# EAGLE schematic Auto_Final_v2.0 (EAGLE 8.0.1)
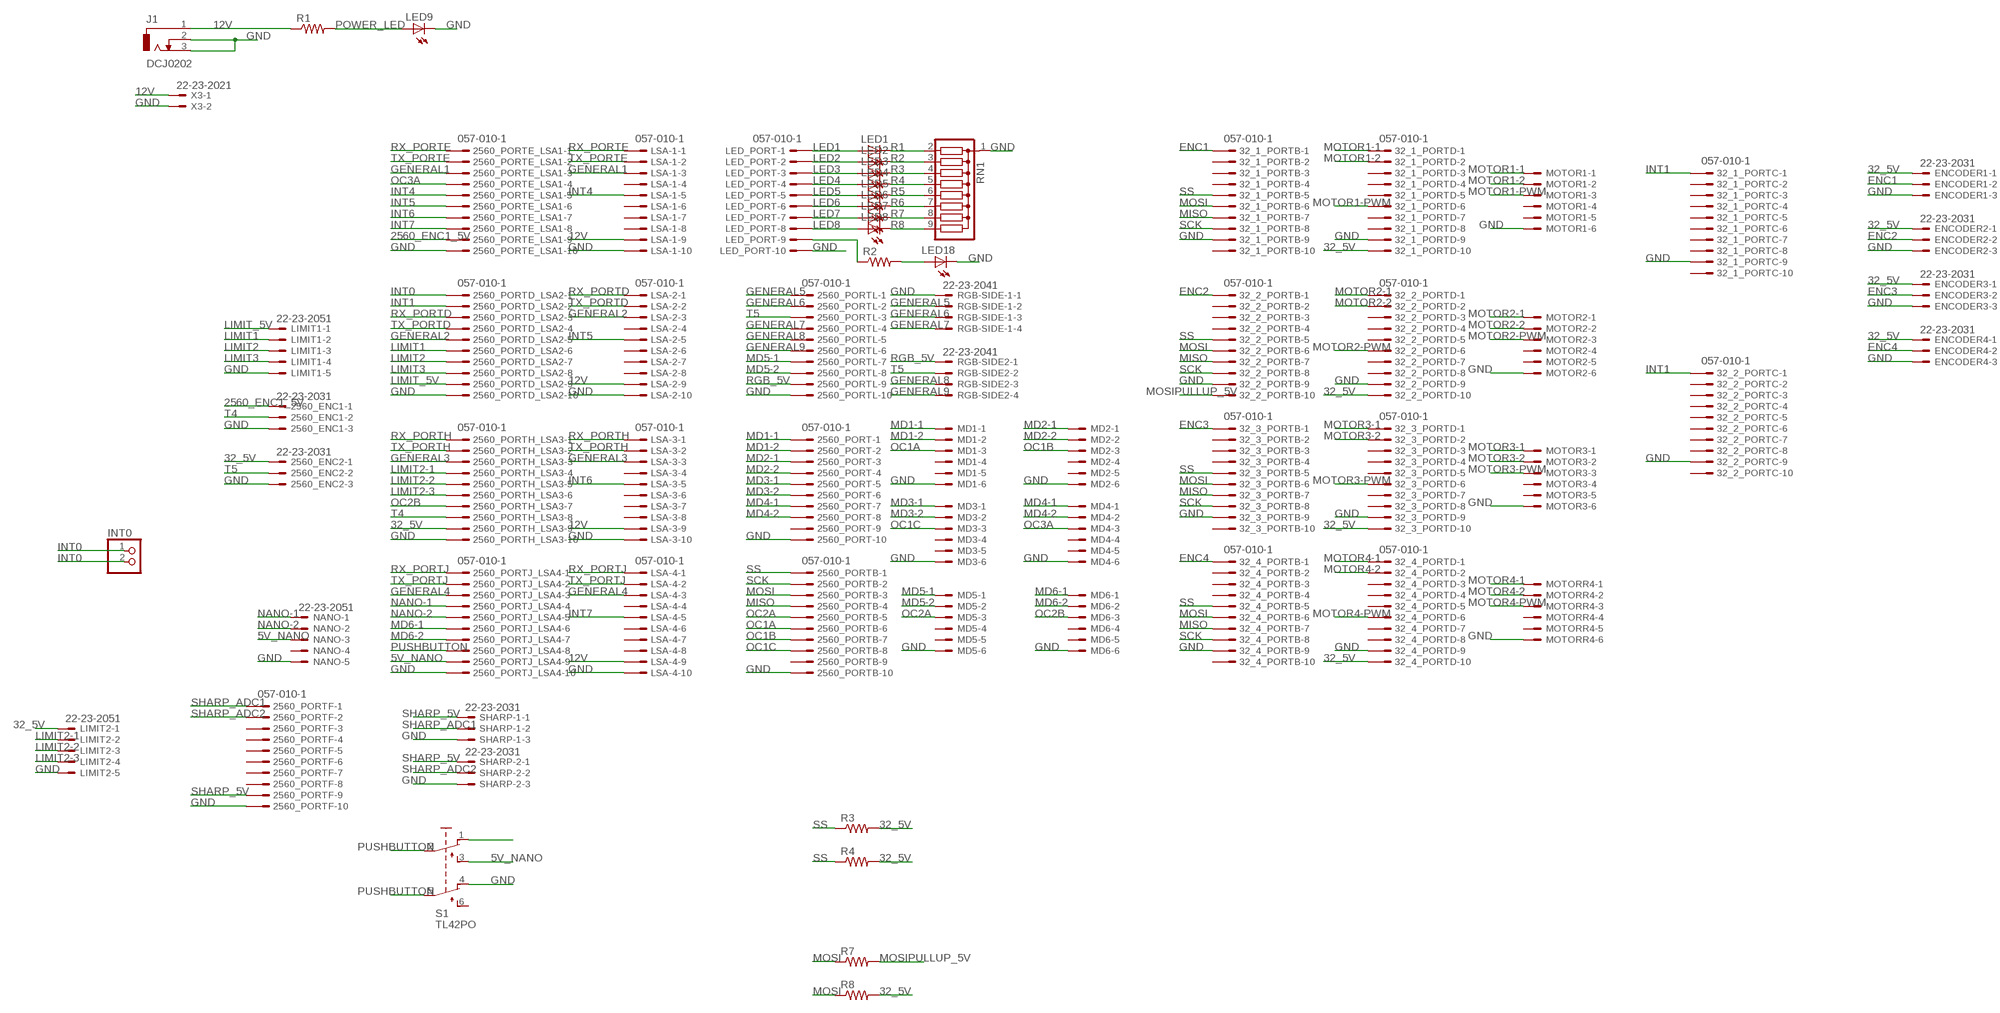
[diagram p0: schematic, sheet 1]

## Parts
32_1_PORTB  057-010-1  [057-010-1]
32_1_PORTC  057-010-1  [057-010-1]
32_1_PORTD  057-010-1  [057-010-1]
32_2_PORTB  057-010-1  [057-010-1]
32_2_PORTC  057-010-1  [057-010-1]
32_2_PORTD  057-010-1  [057-010-1]
32_3_PORTB  057-010-1  [057-010-1]
32_3_PORTD  057-010-1  [057-010-1]
32_4_PORTB  057-010-1  [057-010-1]
32_4_PORTD  057-010-1  [057-010-1]
2560_ENC1  22-23-2031  [22-23-2031]
2560_ENC2  22-23-2031  [22-23-2031]
2560_PORT  057-010-1  [057-010-1]
2560_PORTB  057-010-1  [057-010-1]
2560_PORTD_LSA2  057-010-1  [057-010-1]
2560_PORTE_LSA1  057-010-1  [057-010-1]
2560_PORTF  057-010-1  [057-010-1]
2560_PORTH_LSA3  057-010-1  [057-010-1]
2560_PORTJ_LSA4  057-010-1  [057-010-1]
2560_PORTL  057-010-1  [057-010-1]
ENCODER1  22-23-2031  [22-23-2031]
ENCODER2  22-23-2031  [22-23-2031]
ENCODER3  22-23-2031  [22-23-2031]
ENCODER4  22-23-2031  [22-23-2031]
INT0  PINHD-1X2  [1X02]
J1  DCJ0202  [DCJ0202]
LED1  LED3MM  [LED3MM]
LED2  LED3MM  [LED3MM]
LED3  LED3MM  [LED3MM]
LED4  LED3MM  [LED3MM]
LED5  LED3MM  [LED3MM]
LED6  LED3MM  [LED3MM]
LED7  LED3MM  [LED3MM]
LED8  LED3MM  [LED3MM]
LED9  LED5MM  [LED5MM]
LED18  LED3MM  [LED3MM]
LED_PORT  057-010-1  [057-010-1]
LIMIT1  22-23-2051  [22-23-2051]
LIMIT2  22-23-2051  [22-23-2051]
LSA-1  057-010-1  [057-010-1]
LSA-2  057-010-1  [057-010-1]
LSA-3  057-010-1  [057-010-1]
LSA-4  057-010-1  [057-010-1]
MD1  22-23-2061  [22-23-2061]
MD2  22-23-2061  [22-23-2061]
MD3  22-23-2061  [22-23-2061]
MD4  22-23-2061  [22-23-2061]
MD5  22-23-2061  [22-23-2061]
MD6  22-23-2061  [22-23-2061]
MOTOR1  22-23-2061  [22-23-2061]
MOTOR2  22-23-2061  [22-23-2061]
MOTOR3  22-23-2061  [22-23-2061]
MOTORR4  22-23-2061  [22-23-2061]
NANO  22-23-2051  [22-23-2051]
R1  R-US_0204/7  [0204/7]
R2  R-US_0204/7  [0204/7]
R3  R-US_0204/7  [0204/7]
R4  R-US_0204/7  [0204/7]
R7  R-US_0204/7  [0204/7]
R8  R-US_0204/7  [0204/7]
RGB-SIDE2  22-23-2041  [22-23-2041]
RGB-SIDE-1  22-23-2041  [22-23-2041]
RN1  G08R  [SIL9]
S1  TL42PO  [TL4XPO]
SHARP-1  22-23-2031  [22-23-2031]
SHARP-2  22-23-2031  [22-23-2031]
X3  22-23-2021  [22-23-2021]

## Nets
5V_NANO: 2560_PORTJ_LSA4.9 NANO.3 S1.3(S)
12V: J1.1 LSA-1.9 LSA-2.9 LSA-3.9 LSA-4.9 R1.1 X3.1
32_5V: 32_1_PORTD.10 32_2_PORTD.10 32_3_PORTD.10 32_4_PORTD.10 2560_ENC2.1 2560_PORTH_LSA3.9 ENCODER1.1 ENCODER2.1 ENCODER3.1 ENCODER4.1 LIMIT2.1 R3.2 R4.2 R8.2
2560_ENC1_5V: 2560_ENC1.1 2560_PORTE_LSA1.9
2560_PLED: LED_PORT.9 R2.1
ENC1: 32_1_PORTB.1 ENCODER1.2
ENC2: 32_2_PORTB.1 ENCODER2.2
ENC3: 32_3_PORTB.1 ENCODER3.2
ENC4: 32_4_PORTB.1 ENCODER4.2
GENERAL1: 2560_PORTE_LSA1.3 LSA-1.3
GENERAL2: 2560_PORTD_LSA2.5 LSA-2.3
GENERAL3: 2560_PORTH_LSA3.3 LSA-3.3
GENERAL4: 2560_PORTJ_LSA4.3 LSA-4.3
GENERAL5: 2560_PORTL.1 RGB-SIDE-1.2
GENERAL6: 2560_PORTL.2 RGB-SIDE-1.3
GENERAL7: 2560_PORTL.4 RGB-SIDE-1.4
GENERAL8: 2560_PORTL.5 RGB-SIDE2.3
GENERAL9: 2560_PORTL.6 RGB-SIDE2.4
GND: 32_1_PORTB.9 32_1_PORTC.9 32_1_PORTD.9 32_2_PORTB.9 32_2_PORTC.9 32_2_PORTD.9 32_3_PORTB.9 32_3_PORTD.9 32_4_PORTB.9 32_4_PORTD.9 2560_ENC1.3 2560_ENC2.3 2560_PORT.10 2560_PORTB.10 2560_PORTD_LSA2.10 2560_PORTE_LSA1.10 2560_PORTF.10 2560_PORTH_LSA3.10 2560_PORTJ_LSA4.10 2560_PORTL.10 ENCODER1.3 ENCODER2.3 ENCODER3.3 ENCODER4.3 J1.2 J1.3 LED9.K(C) LED18.K(C) LED_PORT.10 LIMIT1.5 LIMIT2.5 LSA-1.10 LSA-2.10 LSA-3.10 LSA-4.10 MD1.6 MD2.6 MD3.6 MD4.6 MD5.6 MD6.6 MOTOR1.6 MOTOR2.6 MOTOR3.6 MOTORR4.6 NANO.5 RGB-SIDE-1.1 RN1.1 S1.4(O1) SHARP-1.3 SHARP-2.3 X3.2
INT0: 2560_PORTD_LSA2.1 INT0.1 INT0.2
INT1: 32_1_PORTC.1 32_2_PORTC.1 2560_PORTD_LSA2.2
INT4: 2560_PORTE_LSA1.5 LSA-1.5
INT5: 2560_PORTE_LSA1.6 LSA-2.5
INT6: 2560_PORTE_LSA1.7 LSA-3.5
INT7: 2560_PORTE_LSA1.8 LSA-4.5
LED1: LED1.A LED_PORT.1
LED2: LED2.A LED_PORT.2
LED3: LED3.A LED_PORT.3
LED4: LED4.A LED_PORT.4
LED5: LED5.A LED_PORT.5
LED6: LED6.A LED_PORT.6
LED7: LED7.A LED_PORT.7
LED8: LED8.A LED_PORT.8
LIMIT1: 2560_PORTD_LSA2.6 LIMIT1.2
LIMIT2: 2560_PORTD_LSA2.7 LIMIT1.3
LIMIT2-1: 2560_PORTH_LSA3.4 LIMIT2.2
LIMIT2-2: 2560_PORTH_LSA3.5 LIMIT2.3
LIMIT2-3: 2560_PORTH_LSA3.6 LIMIT2.4
LIMIT3: 2560_PORTD_LSA2.8 LIMIT1.4
LIMIT_5V: 2560_PORTD_LSA2.9 LIMIT1.1
MD1-1: 2560_PORT.1 MD1.1
MD1-2: 2560_PORT.2 MD1.2
MD2-1: 2560_PORT.3 MD2.1
MD2-2: 2560_PORT.4 MD2.2
MD3-1: 2560_PORT.5 MD3.1
MD3-2: 2560_PORT.6 MD3.2
MD4-1: 2560_PORT.7 MD4.1
MD4-2: 2560_PORT.8 MD4.2
MD5-1: 2560_PORTL.7 MD5.1
MD5-2: 2560_PORTL.8 MD5.2
MD6-1: 2560_PORTJ_LSA4.6 MD6.1
MD6-2: 2560_PORTJ_LSA4.7 MD6.2
MISO: 32_1_PORTB.7 32_2_PORTB.7 32_3_PORTB.7 32_4_PORTB.7 2560_PORTB.4
MOSI: 32_1_PORTB.6 32_2_PORTB.6 32_3_PORTB.6 32_4_PORTB.6 2560_PORTB.3 R7.1 R8.1
MOSIPULLUP_5V: 32_2_PORTB.10 R7.2
MOTOR1-1: 32_1_PORTD.1 MOTOR1.1
MOTOR1-2: 32_1_PORTD.2 MOTOR1.2
MOTOR1-PWM: 32_1_PORTD.6 MOTOR1.3
MOTOR2-1: 32_2_PORTD.1 MOTOR2.1
MOTOR2-2: 32_2_PORTD.2 MOTOR2.2
MOTOR2-PWM: 32_2_PORTD.6 MOTOR2.3
MOTOR3-1: 32_3_PORTD.1 MOTOR3.1
MOTOR3-2: 32_3_PORTD.2 MOTOR3.2
MOTOR3-PWM: 32_3_PORTD.6 MOTOR3.3
MOTOR4-1: 32_4_PORTD.1 MOTORR4.1
MOTOR4-2: 32_4_PORTD.2 MOTORR4.2
MOTOR4-PWM: 32_4_PORTD.6 MOTORR4.3
N$3: S1.1(O)
NANO-1: 2560_PORTJ_LSA4.4 NANO.1
NANO-2: 2560_PORTJ_LSA4.5 NANO.2
OC1A: 2560_PORTB.6 MD1.3
OC1B: 2560_PORTB.7 MD2.3
OC1C: 2560_PORTB.8 MD3.3
OC2A: 2560_PORTB.5 MD5.3
OC2B: 2560_PORTH_LSA3.7 MD6.3
OC3A: 2560_PORTE_LSA1.4 MD4.3
POWER_LED: LED9.A R1.2
POWERLED2560: LED18.A R2.2
PUSHBUTTON: 2560_PORTJ_LSA4.8 S1.2(P) S1.5(P1)
R1: LED1.K(C) RN1.2
R2: LED2.K(C) RN1.3
R3: LED3.K(C) RN1.4
R4: LED4.K(C) RN1.5
R5: LED5.K(C) RN1.6
R6: LED6.K(C) RN1.7
R7: LED7.K(C) RN1.8
R8: LED8.K(C) RN1.9
RGB_5V: 2560_PORTL.9 RGB-SIDE2.1
RX_PORTD: 2560_PORTD_LSA2.3 LSA-2.1
RX_PORTE: 2560_PORTE_LSA1.1 LSA-1.1
RX_PORTH: 2560_PORTH_LSA3.1 LSA-3.1
RX_PORTJ: 2560_PORTJ_LSA4.1 LSA-4.1
SCK: 32_1_PORTB.8 32_2_PORTB.8 32_3_PORTB.8 32_4_PORTB.8 2560_PORTB.2
SHARP_5V: 2560_PORTF.9 SHARP-1.1 SHARP-2.1
SHARP_ADC1: 2560_PORTF.1 SHARP-1.2
SHARP_ADC2: 2560_PORTF.2 SHARP-2.2
SS: 32_1_PORTB.5 32_2_PORTB.5 32_3_PORTB.5 32_4_PORTB.5 2560_PORTB.1 R3.1 R4.1
T4: 2560_ENC1.2 2560_PORTH_LSA3.8
T5: 2560_ENC2.2 2560_PORTL.3 RGB-SIDE2.2
TX_PORTD: 2560_PORTD_LSA2.4 LSA-2.2
TX_PORTE: 2560_PORTE_LSA1.2 LSA-1.2
TX_PORTH: 2560_PORTH_LSA3.2 LSA-3.2
TX_PORTJ: 2560_PORTJ_LSA4.2 LSA-4.2
Unconnected: 32_1_PORTB.2 32_1_PORTB.3 32_1_PORTB.4 32_1_PORTB.10 32_1_PORTC.2 32_1_PORTC.3 32_1_PORTC.4 32_1_PORTC.5 32_1_PORTC.6 32_1_PORTC.7 32_1_PORTC.8 32_1_PORTC.10 32_1_PORTD.3 32_1_PORTD.4 32_1_PORTD.5 32_1_PORTD.7 32_1_PORTD.8 32_2_PORTB.2 32_2_PORTB.3 32_2_PORTB.4 32_2_PORTC.2 32_2_PORTC.3 32_2_PORTC.4 32_2_PORTC.5 32_2_PORTC.6 32_2_PORTC.7 32_2_PORTC.8 32_2_PORTC.10 32_2_PORTD.3 32_2_PORTD.4 32_2_PORTD.5 32_2_PORTD.7 32_2_PORTD.8 32_3_PORTB.2 32_3_PORTB.3 32_3_PORTB.4 32_3_PORTB.10 32_3_PORTD.3 32_3_PORTD.4 32_3_PORTD.5 32_3_PORTD.7 32_3_PORTD.8 32_4_PORTB.2 32_4_PORTB.3 32_4_PORTB.4 32_4_PORTB.10 32_4_PORTD.3 32_4_PORTD.4 32_4_PORTD.5 32_4_PORTD.7 32_4_PORTD.8 2560_PORT.9 2560_PORTB.9 2560_PORTF.3 2560_PORTF.4 2560_PORTF.5 2560_PORTF.6 2560_PORTF.7 2560_PORTF.8 LSA-1.4 LSA-1.6 LSA-1.7 LSA-1.8 LSA-2.4 LSA-2.6 LSA-2.7 LSA-2.8 LSA-3.4 LSA-3.6 LSA-3.7 LSA-3.8 LSA-4.4 LSA-4.6 LSA-4.7 LSA-4.8 MD1.4 MD1.5 MD2.4 MD2.5 MD3.4 MD3.5 MD4.4 MD4.5 MD5.4 MD5.5 MD6.4 MD6.5 MOTOR1.4 MOTOR1.5 MOTOR2.4 MOTOR2.5 MOTOR3.4 MOTOR3.5 MOTORR4.4 MOTORR4.5 NANO.4 S1.6(S1)

## Library data of the parts
32_1_PORTB 32_1_PORTC 32_1_PORTD 32_2_PORTB 32_2_PORTC 32_2_PORTD 32_3_PORTB 32_3_PORTD 32_4_PORTB 32_4_PORTD 2560_PORT 2560_PORTB 2560_PORTD_LSA2 2560_PORTE_LSA1 2560_PORTF 2560_PORTH_LSA3 2560_PORTJ_LSA4 2560_PORTL LED_PORT LSA-1-LSA-4 = con-panduit:057-010-: CONNECTOR 10-pin series 057 contact pc board low profile headers; OC_FARNELL: unknown; OC_NEWARK: unknown
2560_ENC1 2560_ENC2 ENCODER1-ENCODER4 SHARP-1 SHARP-2 = con-molex:22-23-2031: .100" (2.54mm) Center Header - 3 Pin; MF: MOLEX; MPN: 22-23-2031; OC_FARNELL: 1462950; OC_NEWARK: 30C0862
INT0 = pinhead:PINHD-1X2: PIN HEADER
J1 = con-jack:DCJ0202: DC POWER JACK Source: DCJ0202.pdf; OC_FARNELL: unknown; OC_NEWARK: unknown
LED1-LED9 LED18 = led:LED: LED OSRAM: - CHIPLED LG R971, LG N971, LY N971, LG Q971, LY Q971, LO R971, LY R971 LH N974, LH R974 LS Q976, LO Q976, LY Q976 LO Q996 - Hyper CHIPLED LW Q18S LB Q993, LB Q99A, LB R99A - SideLED LS A670, LO A670, LY A670, LG A670, LP A670 LB A673, LV A673, LT A673, LW A673 LH A674 LY A675 LS A676, LA A676, LO A676, LY A676, LW A676 LS A679, LY A679, LG A679 - Hyper Micro SIDELED® LS Y876, LA Y876, LO Y876, LY Y876 LT Y87S - SmartLED LW L88C, LW L88S LB L89C, LB L89S, LG L890 LS L89K, LO L89K, LY L89K LS L896, LA L896, LO L896, LY L896 - TOPLED LS T670, LO T670, LY T670, LG T670, LP T670 LSG T670, LSP T670, LSY T670, LOP T670, LYG T670 LG T671, LOG T671, LSG T671 LB T673, LV T673, LT T673, LW T673 LH T674 LS T676, LA T676, LO T676, LY T676, LB T676, LH T676, LSB T676, LW T676 LB T67C, LV T67C, LT T67C, LS T67K, LO T67K, LY T67K, LW E67C LS E67B, LA E67B, LO E67B, LY E67B, LB E67C, LV E67C, LT E67C LW T67C LS T679, LY T679, LG T679 LS T770, LO T770, LY T770, LG T770, LP T770 LB T773, LV T773, LT T773, LW T773 LH T774 LS E675, LA E675, LY E675, LS T675 LS T776, LA T776, LO T776, LY T776, LB T776 LHGB T686 LT T68C, LB T68C - Hyper Mini TOPLED® LB M676 - Mini TOPLED Santana® LG M470 LS M47K, LO M47K, LY M47K Source: http://www.osram.convergy.de LUXEON: - LUMILED® LXK2-PW12-R00, LXK2-PW12-S00, LXK2-PW14-U00, LXK2-PW14-V00 LXK2-PM12-R00, LXK2-PM12-S00, LXK2-PM14-U00 LXK2-PE12-Q00, LXK2-PE12-R00, LXK2-PE12-S00, LXK2-PE14-T00, LXK2-PE14-U00 LXK2-PB12-K00, LXK2-PB12-L00, LXK2-PB12-M00, LXK2-PB14-N00, LXK2-PB14-P00, LXK2-PB14-Q00 LXK2-PR12-L00, LXK2-PR12-M00, LXK2-PR14-Q00, LXK2-PR14-R00 LXK2-PD12-Q00, LXK2-PD12-R00, LXK2-PD12-S00 LXK2-PH12-R00, LXK2-PH12-S00 LXK2-PL12-P00, LXK2-PL12-Q00, LXK2-PL12-R00 Source: www.luxeon.com KINGBRIGHT: KA-3528ASYC Source: www.kingbright.com
LIMIT1 LIMIT2 NANO = con-molex:22-23-2051: .100" (2.54mm) Center Header - 5 Pin; MF: MOLEX; MPN: 22-23-2051; OC_FARNELL: 1462952; OC_NEWARK: 38C9178
MD1-MD6 MOTOR1-MOTOR3 MOTORR4 = con-molex:22-23-2061: .100" (2.54mm) Center Header - 6 Pin; MF: MOLEX; MPN: 22-23-2061; OC_FARNELL: 1462922; OC_NEWARK: 27C1933
R1-R4 R7 R8 = rcl:R-US_: RESISTOR, American symbol
RGB-SIDE2 RGB-SIDE-1 = con-molex:22-23-2041: .100" (2.54mm) Center Header - 4 Pin; MF: MOLEX; MPN: 22-23-2041; OC_FARNELL: 1462920; OC_NEWARK: 38C0355
RN1 = resistor-sil:G08R: SIL RESISTOR; OC_FARNELL: unknown; OC_NEWARK: unknown
S1 = switch:TL42PO: TINY SWITCH ON - MOM Source: http://www2.produktinfo.conrad.com/datenblaetter/700000-724999/705152-da-01-de-Subminiaturschalter_TL_36YO.pdf
X3 = con-molex:22-23-2021: .100" (2.54mm) Center Header - 2 Pin; MF: MOLEX; MPN: 22-23-2021; OC_FARNELL: 1462926; OC_NEWARK: 25C3832